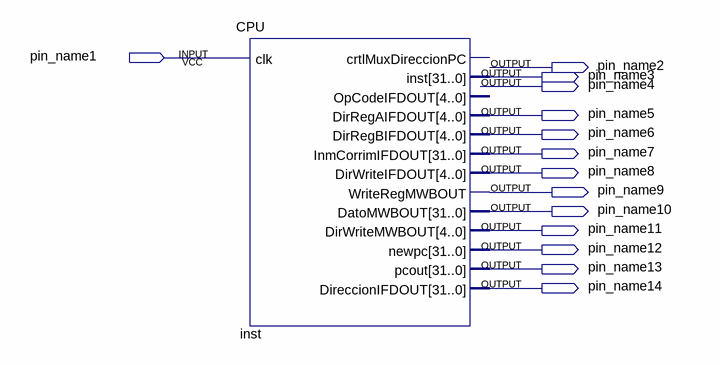
[diagram p0: schematic sheet]
// Quartus schematic CPUDiagram.bdf as structural Verilog: 1 symbols, 14 pins
module CPUDiagram (
  input  pin_name1,
  output pin_name2,
  output pin_name3,
  output pin_name4,
  output pin_name5,
  output pin_name6,
  output pin_name7,
  output pin_name8,
  output pin_name9,
  output pin_name10,
  output pin_name11,
  output pin_name12,
  output pin_name13,
  output pin_name14
);

  CPU inst (
    .clk(pin_name1), .WriteRegMWBOUT(pin_name9), .DatoMWBOUT(pin_name10));  // open: crtlMuxDireccionPC, inst, OpCodeIFDOUT, DirRegAIFDOUT, DirRegBIFDOUT, InmCorrimIFDOUT, DirWriteIFDOUT, DirWriteMWBOUT, newpc, pcout, DireccionIFDOUT
endmodule
